# EAGLE design M219X (EAGLE 6.6.0)
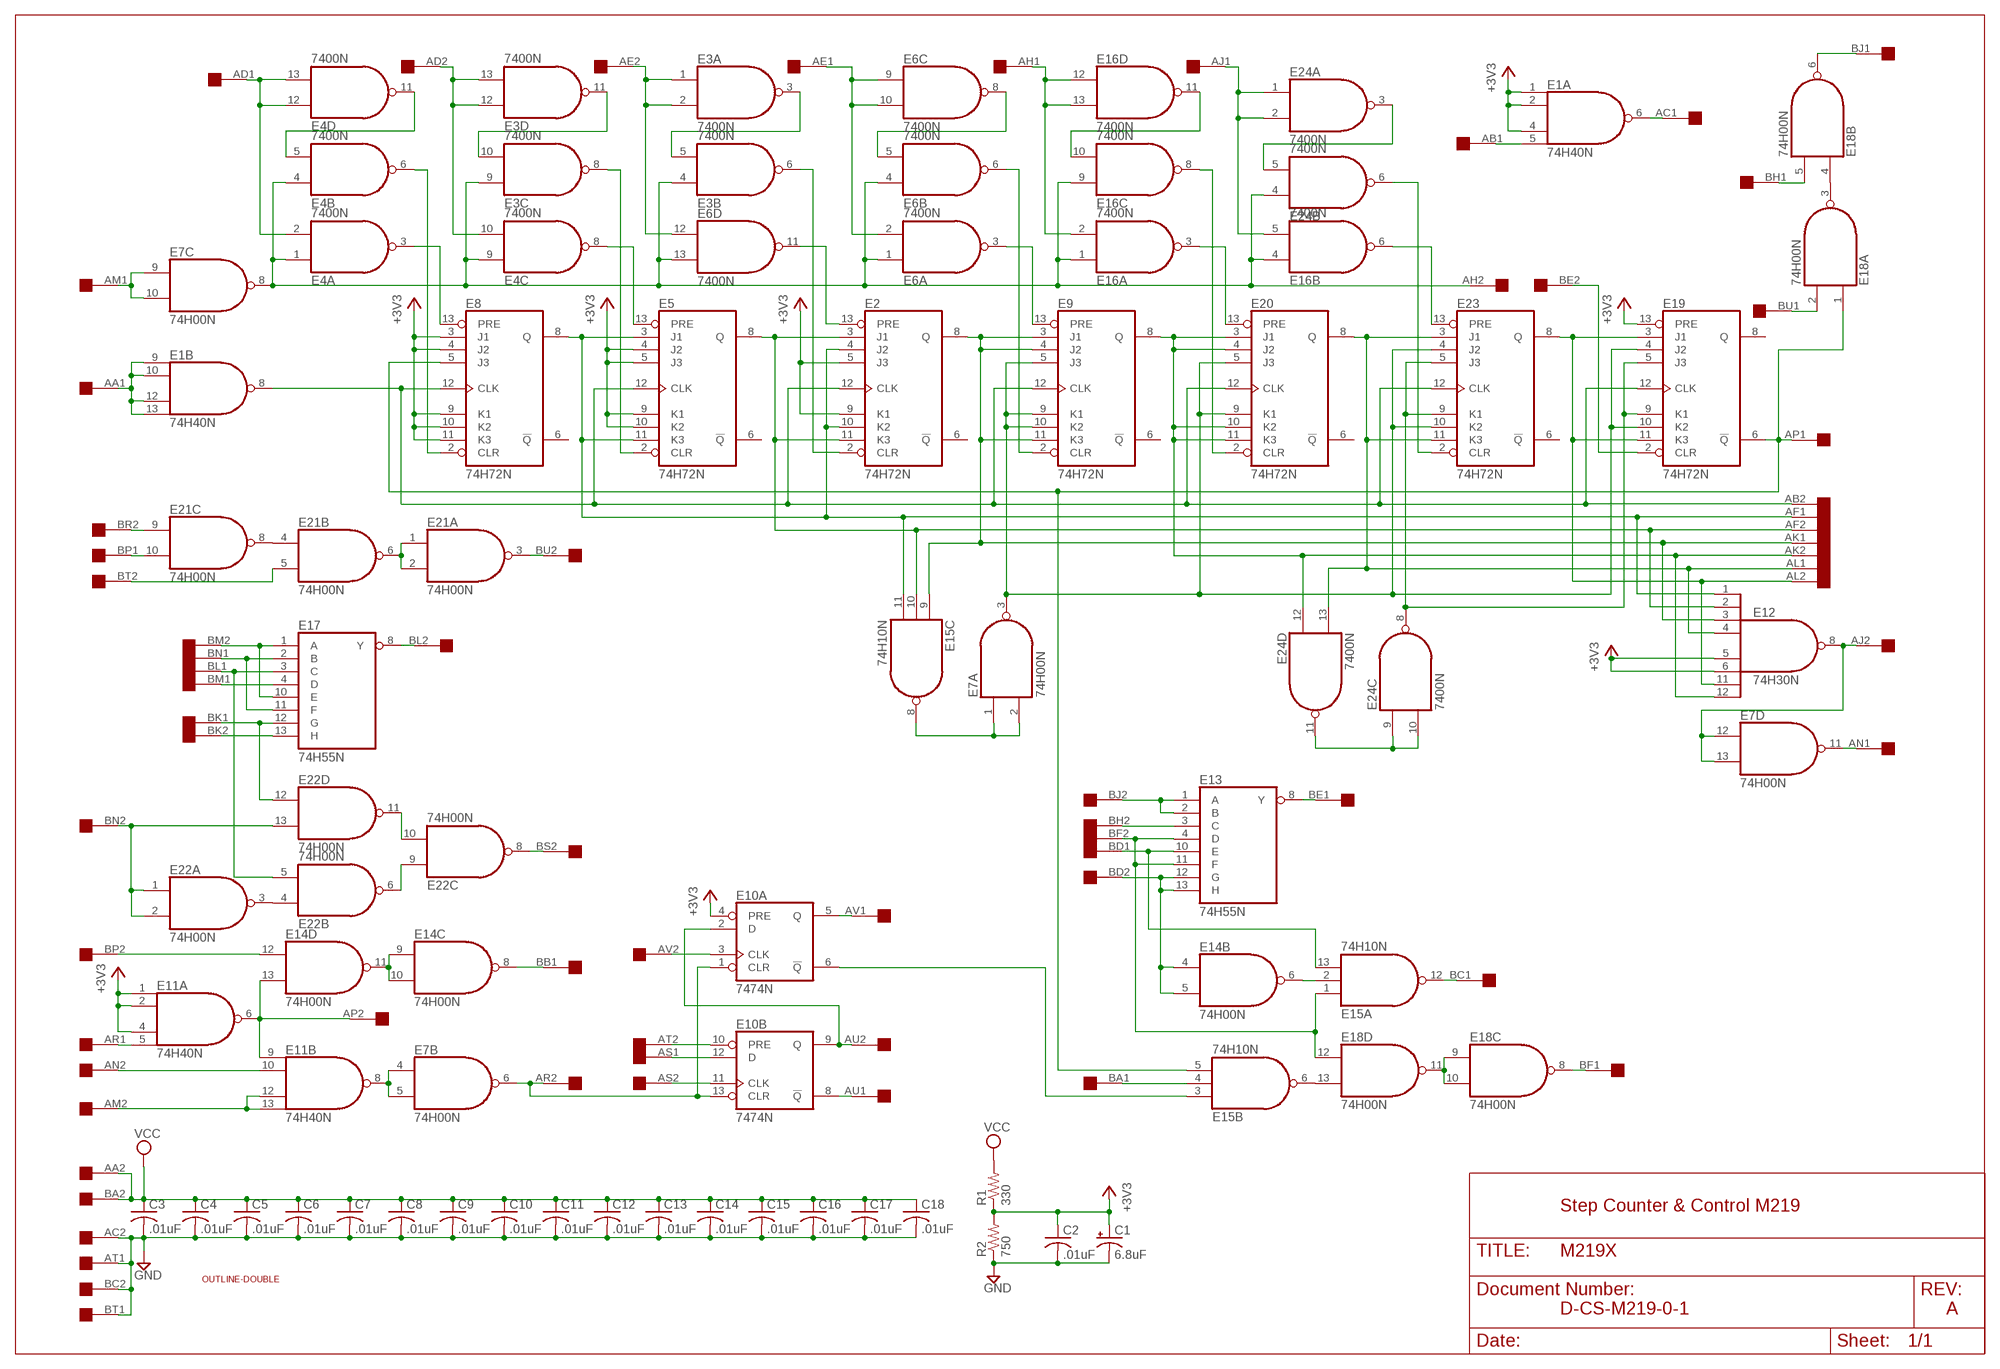
[diagram p0: schematic, sheet 1]

## Parts
C1  6.8uF  CPOL-USE20-8AXIAL  [E12-8]
C2  .01uF  C-US050-025X075  [C050-025X075]
C3  .01uF  C-US050-025X075  [C050-025X075]
C4  .01uF  C-US050-025X075  [C050-025X075]
C5  .01uF  C-US050-025X075  [C050-025X075]
C6  .01uF  C-US050-025X075  [C050-025X075]
C7  .01uF  C-US050-025X075  [C050-025X075]
C8  .01uF  C-US050-025X075  [C050-025X075]
C9  .01uF  C-US050-025X075  [C050-025X075]
C10  .01uF  C-US050-025X075  [C050-025X075]
C11  .01uF  C-US050-025X075  [C050-025X075]
C12  .01uF  C-US050-025X075  [C050-025X075]
C13  .01uF  C-US050-025X075  [C050-025X075]
C14  .01uF  C-US050-025X075  [C050-025X075]
C15  .01uF  C-US050-025X075  [C050-025X075]
C16  .01uF  C-US050-025X075  [C050-025X075]
C17  .01uF  C-US050-025X075  [C050-025X075]
C18  .01uF  C-US050-025X075  [C050-025X075]
E1  74H40N  74S40N  [DIL14]
E2  74H72N  7472N  [DIL14]
E3  7400N  74S00N  [DIL14]
E4  7400N  74S00N  [DIL14]
E5  74H72N  7472N  [DIL14]
E6  7400N  74S00N  [DIL14]
E7  74H00N  74S00N  [DIL14]
E8  74H72N  7472N  [DIL14]
E9  74H72N  7472N  [DIL14]
E10  7474N  74S74N  [DIL14]
E11  74H40N  74S40N  [DIL14]
E12  74H30N  74S30N  [DIL14]
E13  74H55N  74LS55N  [DIL14]
E14  74H00N  74S00N  [DIL14]
E15  74H10N  74S10N  [DIL14]
E16  7400N  74S00N  [DIL14]
E17  74H55N  74LS55N  [DIL14]
E18  74H00N  74S00N  [DIL14]
E19  74H72N  7472N  [DIL14]
E20  74H72N  7472N  [DIL14]
E21  74H00N  74S00N  [DIL14]
E22  74H00N  74S00N  [DIL14]
E23  74H72N  7472N  [DIL14]
E24  7400N  74S00N  [DIL14]
R1  330  R-US_0207/10  [0207/10]
R2  750  R-US_0207/10  [0207/10]
U$1  OUTLINE-DOUBLE  [DOUBLE]
U$3  DOUBLE  [EDGE-CON4]

## Nets
+3V3 [supply]: C1.+ C2.1 E1.1(A:I0) E1.2(A:I1) E1.4(A:I2) E2.5(J3) E2.9(K1) E5.4(J2) E5.5(J3) E5.9(K1) E5.10(K2) E8.3(J1) E8.4(J2) E8.9(K1) E8.10(K2) E8.11(K3) E10.4(A:PRE) E11.1(A:I0) E11.2(A:I1) E11.4(A:I2) E12.5(I4) E12.6(I5) E19.13(PRE) R1.1 R2.2
GND [supply]: C1.- C2.2 C3.2 C4.2 C5.2 C6.2 C7.2 C8.2 C9.2 C10.2 C11.2 C12.2 C13.2 C14.2 C15.2 C16.2 C17.2 C18.2 R2.1 U$3.AC2 U$3.AT1 U$3.BC2 U$3.BT1
N$1: E1.9(B:I0) E1.10(B:I1) E1.12(B:I2) E1.13(B:I3) U$3.AA1
N$2: E1.8(B:O) E2.12(CLK) E5.12(CLK) E8.12(CLK) E9.12(CLK) E19.12(CLK) E20.12(CLK) E23.12(CLK) U$3.AB2
N$3: E4.2(A:I1) E4.12(D:I0) E4.13(D:I1) U$3.AD1
N$4: E7.9(C:I0) E7.10(C:I1) U$3.AM1
N$5: E8.5(J3) E15.5(B:I2) E18.1(A:I0) E19.6(!Q) U$3.AP1
N$6: E3.4(B:I0) E3.9(C:I0) E4.1(A:I0) E4.4(B:I0) E4.9(C:I0) E6.1(A:I0) E6.4(B:I0) E6.13(D:I1) E7.8(C:O) E16.1(A:I0) E16.4(B:I0) E16.9(C:I0) E24.4(B:I0) U$3.AH2
N$7: E4.5(B:I1) E4.11(D:O)
N$8: E4.3(A:O) E8.13(PRE)
N$9: E4.8(C:O) E5.13(PRE)
N$10: E3.12(D:I0) E3.13(D:I1) E4.10(C:I1) U$3.AD2
N$11: E6.3(A:O) E9.13(PRE)
N$12: E6.2(A:I1) E6.9(C:I0) E6.10(C:I1) U$3.AE1
N$13: E3.1(A:I0) E3.2(A:I1) E6.12(D:I0) U$3.AE2
N$14: E2.13(PRE) E6.11(D:O)
N$15: E16.3(A:O) E20.13(PRE)
N$16: E16.6(B:O) E23.13(PRE)
N$17: E4.6(B:O) E8.2(CLR)
N$18: E3.8(C:O) E5.2(CLR)
N$19: E3.10(C:I1) E3.11(D:O)
N$20: E2.4(J2) E2.10(K2) E5.3(J1) E5.11(K3) E8.8(Q) E12.1(I0) E15.11(C:I2) U$3.AF1
N$21: E2.3(J1) E2.11(K3) E5.8(Q) E12.2(I1) E15.10(C:I1) U$3.AF2
N$22: E2.8(Q) E9.3(J1) E9.4(J2) E9.11(K3) E12.3(I2) E15.9(C:I0) U$3.AK1
N$23: E9.8(Q) E12.12(I7) E20.3(J1) E20.4(J2) E20.10(K2) E20.11(K3) E24.12(D:I0) U$3.AK2
N$24: E12.4(I3) E20.8(Q) E23.3(J1) E23.11(K3) E24.13(D:I1) U$3.AL1
N$25: E12.11(I6) E19.3(J1) E19.11(K3) E23.8(Q) U$3.AL2
N$26: E2.2(CLR) E3.6(B:O)
N$27: E3.3(A:O) E3.5(B:I1)
N$28: E6.5(B:I1) E6.8(C:O)
N$29: E6.6(B:O) E9.2(CLR)
N$30: E7.3(A:O) E9.5(J3) E9.9(K1) E9.10(K2) E19.4(J2) E19.10(K2) E20.5(J3) E20.9(K1) E23.4(J2) E23.10(K2)
N$31: E7.1(A:I0) E7.2(A:I1) E15.8(C:O)
N$32: E16.10(C:I1) E16.11(D:O)
N$33: E16.2(A:I1) E16.12(D:I0) E16.13(D:I1) U$3.AH1
N$34: E16.8(C:O) E20.2(CLR)
N$36: E24.3(A:O) E24.5(B:I1)
N$37: E16.5(B:I1) E24.1(A:I0) E24.2(A:I1) U$3.AJ1
N$38: E23.2(CLR) E24.6(B:O)
N$39: E19.5(J3) E19.9(K1) E23.5(J3) E23.9(K1) E24.8(C:O)
N$40: E1.5(A:I3) U$3.AB1
N$41: E24.9(C:I0) E24.10(C:I1) E24.11(D:O)
N$42: E1.6(A:O) U$3.AC1
N$43: E7.12(D:I0) E7.13(D:I1) E12.8(O) U$3.AJ2
N$44: E7.11(D:O) U$3.AN1
N$45: E17.3(C) E22.5(B:I1) U$3.BL1
N$46: E18.3(A:O) E18.4(B:I0)
N$47: E18.2(A:I1) U$3.BU1
N$48: E18.5(B:I1) U$3.BH1
N$49: E18.6(B:O) U$3.BJ1
N$50: E21.4(B:I0) E21.8(C:O)
N$51: E21.9(C:I0) U$3.BR2
N$52: E21.10(C:I1) U$3.BP1
N$53: E21.5(B:I1) U$3.BT2
N$54: E21.1(A:I0) E21.2(A:I1) E21.6(B:O)
N$55: E21.3(A:O) U$3.BU2
N$56: E22.6(B:O) E22.9(C:I0)
N$57: E22.10(C:I1) E22.11(D:O)
N$58: E22.3(A:O) E22.4(B:I0)
N$59: E22.1(A:I0) E22.2(A:I1) E22.13(D:I1) U$3.BN2
N$60: E17.12(G) E22.12(D:I0) U$3.BK1
N$61: E17.4(D) U$3.BM1
N$62: E17.1(A) E17.10(E) U$3.BM2
N$63: E17.2(B) E17.11(F) U$3.BN1
N$64: E17.13(H) U$3.BK2
N$65: E17.8(Y) U$3.BL2
N$66: E22.8(C:O) U$3.BS2
N$67: E11.5(A:I3) U$3.AR1
N$68: E11.6(A:O) E11.9(B:I0) E14.13(D:I1) U$3.AP2
N$69: E11.12(B:I2) E11.13(B:I3) U$3.AM2
N$70: E11.10(B:I1) U$3.AN2
N$71: E14.12(D:I0) U$3.BP2
N$72: E14.9(C:I0) E14.10(C:I1) E14.11(D:O)
N$73: E7.4(B:I0) E7.5(B:I1) E11.8(B:O)
N$74: E14.8(C:O) U$3.BB1
N$75: E7.6(B:O) E10.1(A:CLR) E10.13(B:CLR) U$3.AR2
N$76: E10.11(B:CLK) U$3.AS2
N$77: E10.12(B:D) U$3.AS1
N$78: E10.10(B:PRE) U$3.AT2
N$79: E10.2(A:D) E10.9(B:Q) U$3.AU2
N$80: E10.3(A:CLK) U$3.AV2
N$81: E10.5(A:Q) U$3.AV1
N$82: E10.8(B:!Q) U$3.AU1
N$83: E13.1(A) E13.2(B) U$3.BJ2
N$84: E13.3(C) U$3.BH2
N$85: E13.4(D) E13.11(F) E15.1(A:I0) E18.12(D:I0) U$3.BF2
N$86: E13.10(E) E15.13(A:I2) U$3.BD1
N$87: E13.12(G) E13.13(H) E14.4(B:I0) E14.5(B:I1) U$3.BD2
N$88: E14.6(B:O) E15.2(A:I1)
N$89: E13.8(Y) U$3.BE1
N$90: E15.12(A:O) U$3.BC1
N$91: E15.4(B:I1) U$3.BA1
N$92: E15.6(B:O) E18.13(D:I1)
N$93: E10.6(A:!Q) E15.3(B:I0)
N$95: E18.9(C:I0) E18.10(C:I1) E18.11(D:O)
N$96: E18.8(C:O) U$3.BF1
N$97: E19.2(CLR) U$3.BE2
VCC [supply]: C3.1 C4.1 C5.1 C6.1 C7.1 C8.1 C9.1 C10.1 C11.1 C12.1 C13.1 C14.1 C15.1 C16.1 C17.1 C18.1 R1.2 U$3.AA2 U$3.BA2
Unconnected: E1.3(3:NC) E1.11(11:NC) E2.6(!Q) E5.6(!Q) E8.6(!Q) E9.6(!Q) E11.3(3:NC) E11.11(11:NC) E12.9 E12.10 E12.13 E14.1(A:I0) E14.2(A:I1) E14.3(A:O) E19.8(Q) E20.6(!Q) E21.11(D:O) E21.12(D:I0) E21.13(D:I1) E23.6(!Q) U$3.BB2 U$3.BR1 U$3.BS1 U$3.BV1 U$3.BV2

## Notes on the sheet
- Step Counter & Control M219
- D-CS-M219-0-1 | A

## Power pins joined to a net without a drawn wire
GND: E1.7(P:GND) E2.7(GND) E3.7(P:GND) E4.7(P:GND) E5.7(GND) E6.7(P:GND) E7.7(P:GND) E8.7(GND) E9.7(GND) E10.7(P:GND) E11.7(P:GND) E12.7(GND) E13.7(GND) E14.7(P:GND) E15.7(P:GND) E16.7(P:GND) E17.7(GND) E18.7(P:GND) E19.7(GND) E20.7(GND) E21.7(P:GND) E22.7(P:GND) E23.7(GND) E24.7(P:GND)
VCC: E1.14(P:VCC) E2.14(VCC) E3.14(P:VCC) E4.14(P:VCC) E5.14(VCC) E6.14(P:VCC) E7.14(P:VCC) E8.14(VCC) E9.14(VCC) E10.14(P:VCC) E11.14(P:VCC) E12.14(VCC) E13.14(VCC) E14.14(P:VCC) E15.14(P:VCC) E16.14(P:VCC) E17.14(VCC) E18.14(P:VCC) E19.14(VCC) E20.14(VCC) E21.14(P:VCC) E22.14(P:VCC) E23.14(VCC) E24.14(P:VCC)

## Library data of the parts
C1 = dec-con:CPOL-USE20-8AXIAL: A 0.8 inch electrolytic.
C2-C18 = rcl:C-US: CAPACITOR, American symbol
E1 E11 = dec-con:74*40: Dual 4-input NAND gate
E2 E5 E8 E9 E19 E20 E23 = 74xx-us:74*72: AND gated J-K master slave FLIP FLOP, preset and clear
E3 E4 E6 E7 E14 E16 E18 E21 E22 E24 = 74xx-us:74*00: Quad 2-input NAND gate
E10 = 74xx-us:74*74: Dual D type positive edge triggered FLIP FLOP, preset and clear
E12 = dec-con:74*30: 8-input NAND gate
E13 E17 = 74xx-us:74*55: 2-wide 4-input AND OR INVERTER gate
E15 = 74xx-us:74*10: Triple 3-input NAND gate
R1 R2 = rcl:R-US_: RESISTOR, American symbol
U$1 = dec-con:OUTLINE-*: Board outlines for DEC boards.
U$3 = dec-con:DOUBLE: Double-Height DEC board

## Net classes
1 supply: width 0.813 mm

## Board
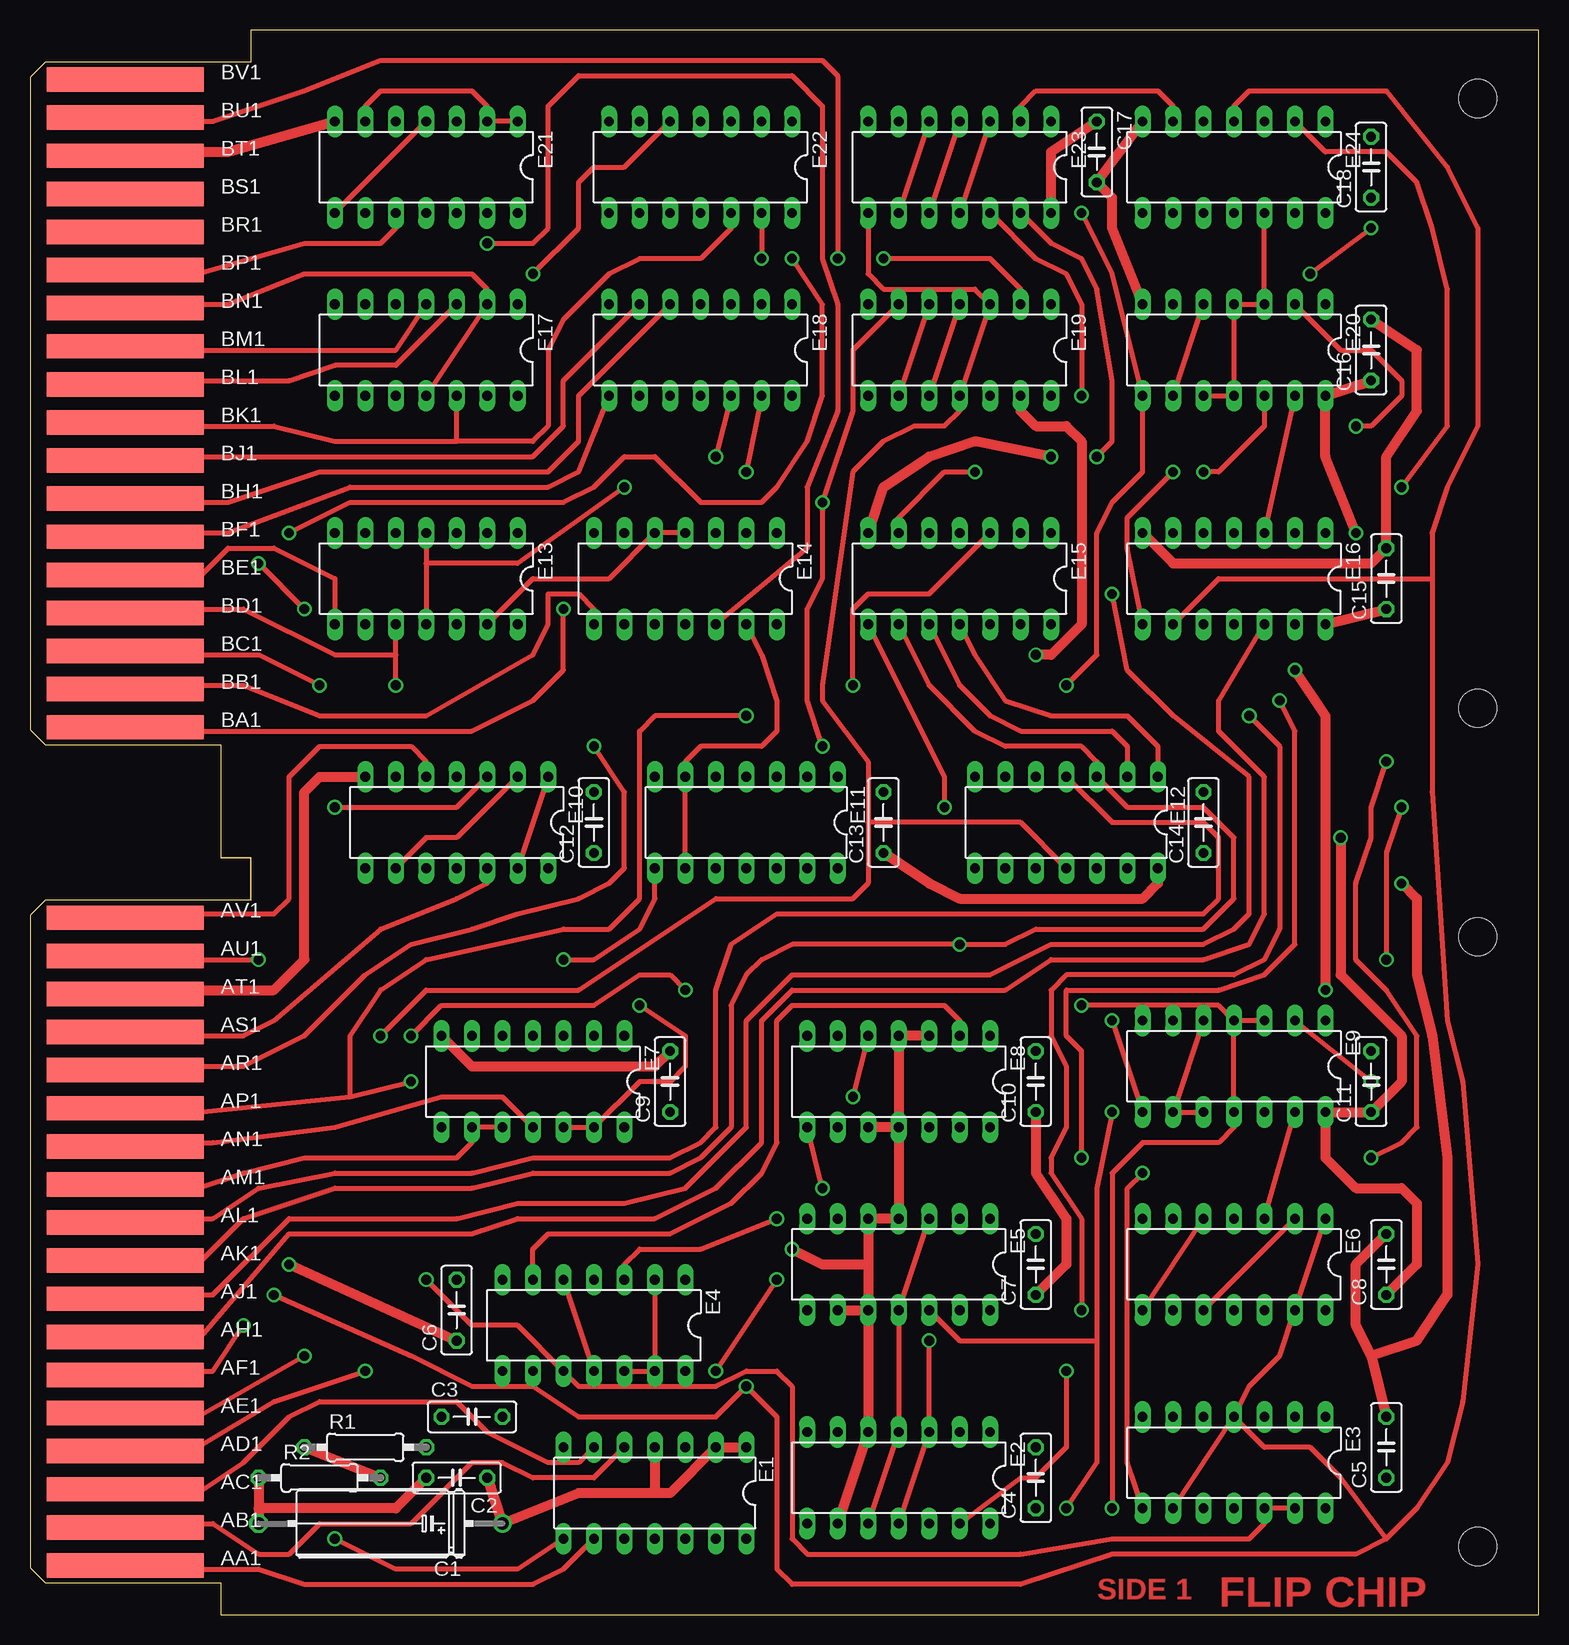
[diagram p1: board, top side]
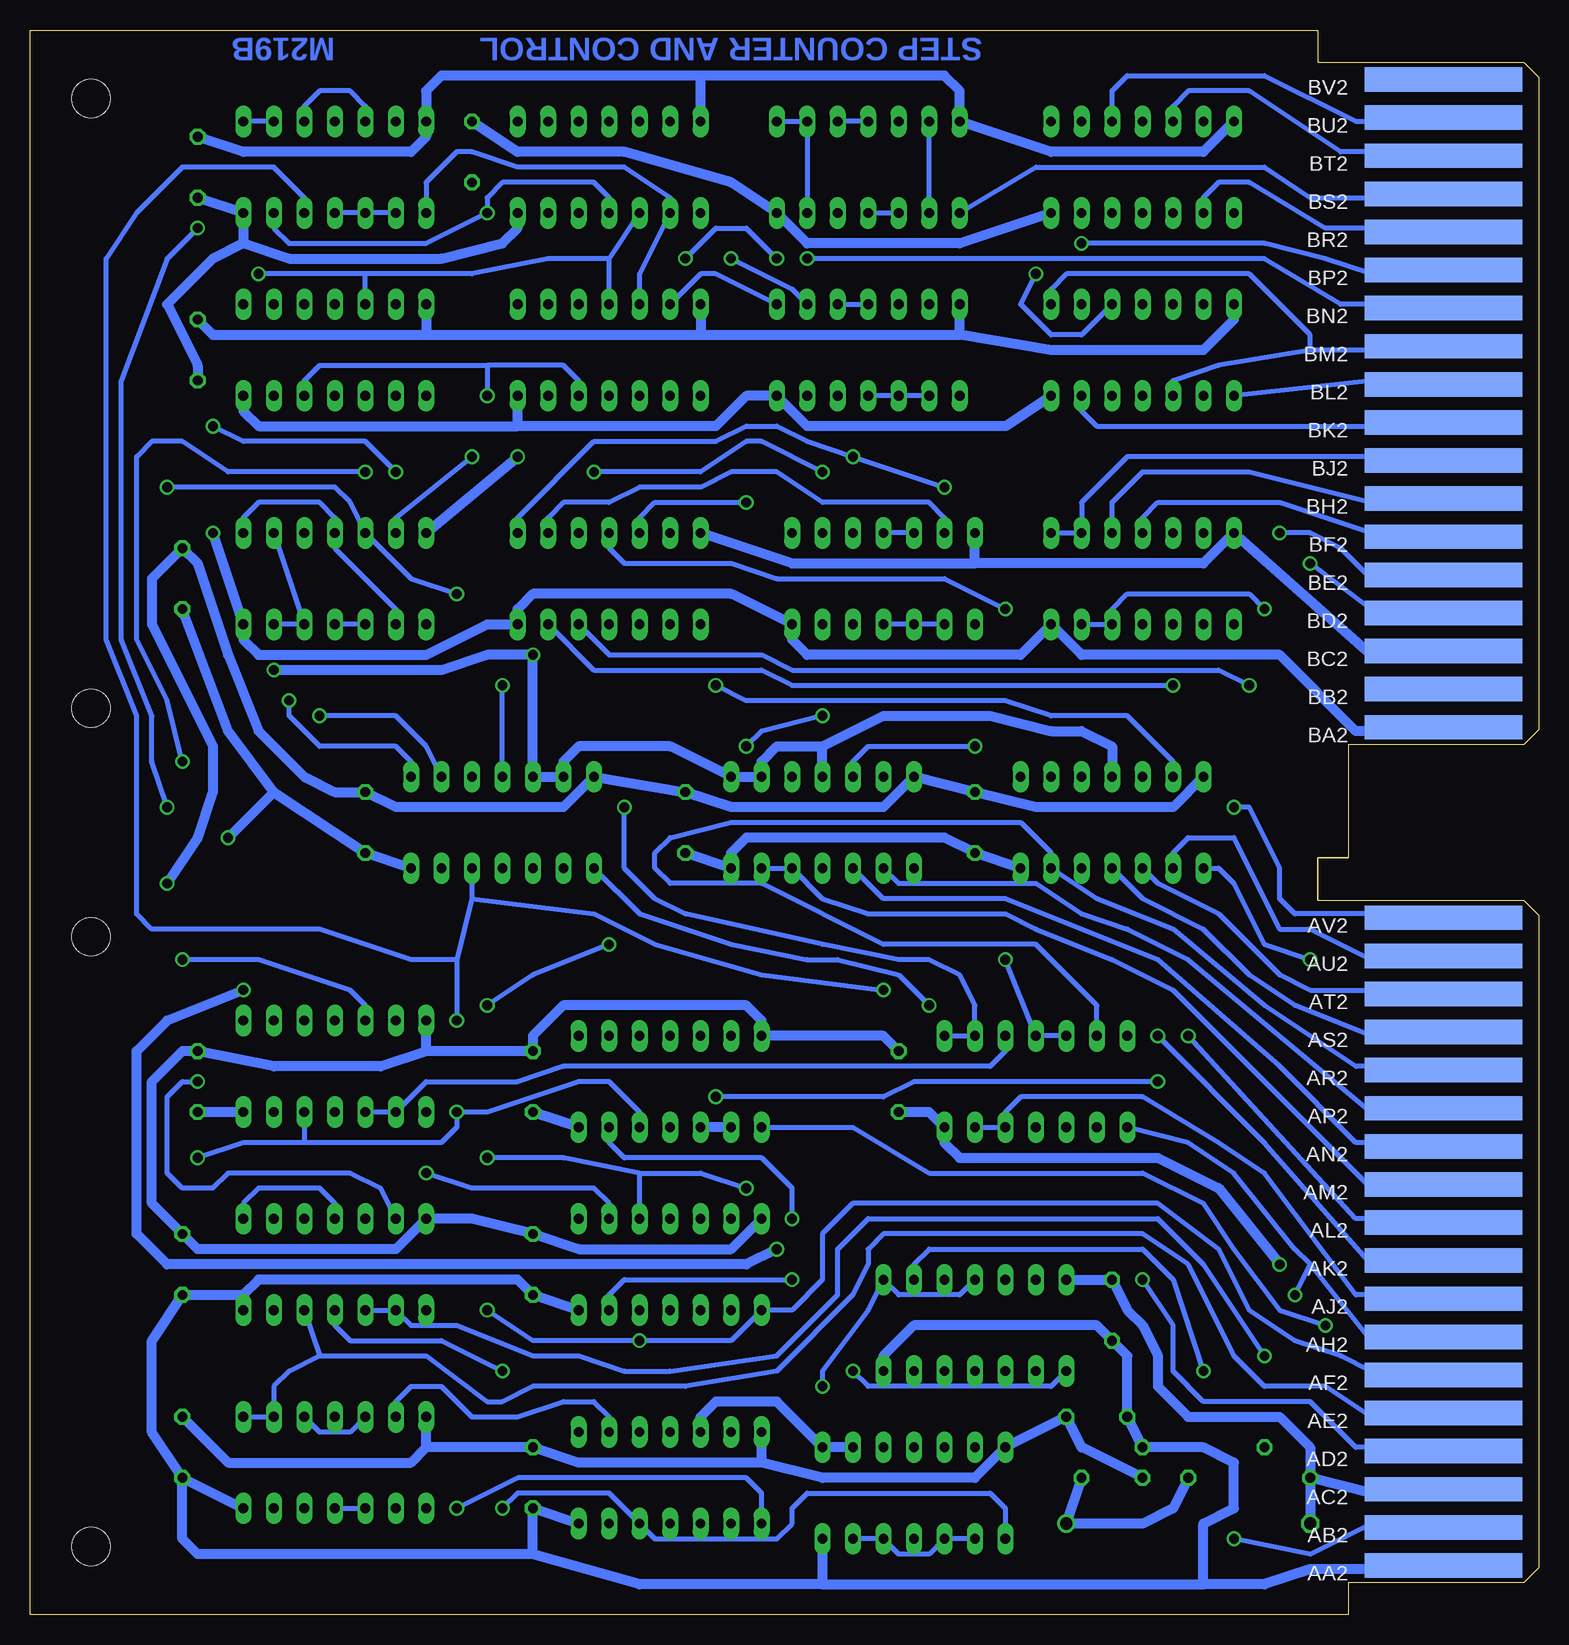
[diagram p2: board, bottom side, seen from below]

Size 125.73 x 132.08 mm. Coordinates in mm from the lower left corner, seen from the top.
Copper layers (1+16): Top 0.035mm / dielectric 1.5mm / Bottom 0.035mm
Design rules "16mils": minimum track width 16mil, minimum drill 32mil, track to track 15mil, track to pad 10mil, pad to pad 10mil, via to via 10mil, smd to smd 10mil, copper to edge 13mil, drill to drill 10mil, minimum pad ring 10mil, minimum via ring 8mil, stop-mask expansion 0mil, vias tented up to drill 0mil, thermal gap 10mil

### Footprints (pad centres in the part's own frame; a part is rotated, then mirrored left to right if it is on the bottom)
E12-8 = drill 1.016: + -10.16,0 | drill 1.016 octagon: - 10.16,0
C050-025X075 = drill 0.813 octagon: 1 -2.54,0; 2 2.54,0
DIL14 = drill 0.813 long: 1 -7.62,-3.81; 2 -5.08,-3.81; 3 -2.54,-3.81; 4 0,-3.81; 5 2.54,-3.81; 6 5.08,-3.81; 7 7.62,-3.81; 8 7.62,3.81; 9 5.08,3.81; 10 2.54,3.81; 11 0,3.81; 12 -2.54,3.81; 13 -5.08,3.81; 14 -7.62,3.81
0207/10 = drill 0.813 octagon: 1 -5.08,0; 2 5.08,0
DOUBLE = hole 3.175: 120.65,56.515; 120.65,5.715; 120.65,75.565; 120.65,126.365
EDGE-CON4 = smd 13.106 x 2.032: AA1 7.938,4.128; AB1 7.938,7.303; AC1 7.938,10.477; AD1 7.938,13.652; AE1 7.938,16.828; AF1 7.938,20.003; AH1 7.938,23.177; AJ1 7.938,26.352; AK1 7.938,29.527; AL1 7.938,32.703; AM1 7.938,35.877; AN1 7.938,39.053; AP1 7.938,42.227; AR1 7.938,45.403; AS1 7.938,48.578; AT1 7.938,51.752; AU1 7.938,54.928; AV1 7.938,58.102; BA1 7.938,73.978; BB1 7.938,77.153; BC1 7.938,80.328; BD1 7.938,83.502; BE1 7.938,86.677; BF1 7.938,89.853; BH1 7.938,93.028; BJ1 7.938,96.203; BK1 7.938,99.377; BL1 7.938,102.552; BM1 7.938,105.728; BN1 7.938,108.903; BP1 7.938,112.078; BR1 7.938,115.252; BS1 7.938,118.427; BT1 7.938,121.603; BU1 7.938,124.778; BV1 7.938,127.953 | smd 13.106 x 2.032 bottom: AA2 7.938,4.128; AB2 7.938,7.303; AC2 7.938,10.477; AD2 7.938,13.652; AE2 7.938,16.828; AF2 7.938,20.003; AH2 7.938,23.177; AJ2 7.938,26.352; AK2 7.938,29.527; AL2 7.938,32.703; AM2 7.938,35.877; AN2 7.938,39.053; AP2 7.938,42.227; AR2 7.938,45.403; AS2 7.938,48.578; AT2 7.938,51.752; AU2 7.938,54.928; AV2 7.938,58.102; BA2 7.938,73.978; BB2 7.938,77.153; BC2 7.938,80.328; BD2 7.938,83.502; BE2 7.938,86.677; BF2 7.938,89.853; BH2 7.938,93.028; BJ2 7.938,96.203; BK2 7.938,99.377; BL2 7.938,102.552; BM2 7.938,105.728; BN2 7.938,108.903; BP2 7.938,112.078; BR2 7.938,115.252; BS2 7.938,118.427; BT2 7.938,121.603; BU2 7.938,124.778; BV2 7.938,127.953

### Placement (x,y rotation side)
C1  29.21,7.62 180 top
C2  35.56,11.43 180 top
C3  36.83,16.51 0 top
C4  83.82,11.43 90 top
C5  113.03,13.97 90 top
C6  35.56,25.4 90 top
C7  83.82,29.21 90 top
C8  113.03,29.21 90 top
C9  53.34,44.45 90 top
C10  83.82,44.45 90 top
C11  111.76,44.45 90 top
C12  46.99,66.04 90 top
C13  71.12,66.04 90 top
C14  97.79,66.04 90 top
C15  113.03,86.36 90 top
C16  111.76,105.41 90 top
C17  88.9,121.92 270 top
C18  111.76,120.65 90 top
E1  52.07,10.16 180 top
E2  72.39,11.43 180 top
E3  100.33,12.7 180 top
E4  46.99,24.13 180 top
E5  72.39,29.21 180 top
E6  100.33,29.21 180 top
E7  41.91,44.45 180 top
E8  72.39,44.45 180 top
E9  100.33,45.72 180 top
E10  35.56,66.04 180 top
E11  59.69,66.04 180 top
E12  86.36,66.04 180 top
E13  33.02,86.36 180 top
E14  54.61,86.36 180 top
E15  77.47,86.36 180 top
E16  100.33,86.36 180 top
E17  33.02,105.41 180 top
E18  55.88,105.41 180 top
E19  77.47,105.41 180 top
E20  100.33,105.41 180 top
E21  33.02,120.65 180 top
E22  55.88,120.65 180 top
E23  77.47,120.65 180 top
E24  100.33,120.65 180 top
R1  27.94,13.97 0 top
R2  24.13,11.43 0 top
U$1  0,0 0 top
U$3  0,0 0 top

### Tracks (layer width: path | path; a pad name or v marks a point on that pad's centre or on a via)
+3V3  (via drill 0.81)
  Top 0.813: R1.1 R2.2 | E2.9 E2.5 E5.10 | E8.11 E5.4 E5.5 69.85,29.21 | E8.11 E8.10 | E5.9 E5.10 | E8.3 E8.4 E8.11 | E19.13 82.55,100.33 83.82,99.06 86.36,99.06 87.63,97.79 87.63,82.55 85.09,80.01 v83.82,80.01 | 69.85,29.21 E5.10 | C2.1 C1.+ 45.72,10.16 52.07,10.16 | E1.1 E1.2 53.34,10.16 52.07,10.16 | E1.4 52.07,10.16 | v105.41,78.74 107.95,74.93 v107.95,52.07 | v63.5,30.48 66.04,29.21 69.85,29.21
  Bottom 0.813: R2.2 30.48,8.89 33.02,7.62 C1.+ C2.1 | E2.5 69.85,16.51 68.58,17.78 63.5,17.78 E1.1 E1.2 | v105.41,78.74 91.44,78.74 87.63,80.01 v83.82,80.01 E12.5 E12.6 81.28,71.12 80.01,72.39 72.39,72.39 E11.1 E11.2 64.77,71.12 63.5,72.39 59.69,72.39 | E11.4 59.69,72.39 | 59.69,72.39 54.61,74.93 45.72,74.93 40.64,73.66 38.1,73.66 35.56,72.39 E10.4 | E8.9 E8.10 | v107.95,52.07 114.3,49.53 116.84,46.99 116.84,31.75 114.3,29.21 66.04,29.21 v63.5,30.48
GND  (via drill 0.81)
  Top 0.813: v114.3,60.96 115.57,59.69 115.57,53.34 116.84,48.26 118.11,38.1 118.11,26.67 115.57,22.86 111.76,21.59 | 111.76,21.59 C5.2 | 111.76,21.59 110.49,24.13 110.49,29.21 C8.2 | U$3.AT1 8.89,52.07 20.32,52.07 22.86,54.61 22.86,68.58 24.13,69.85 E10.7 | C16.2 115.57,105.41 115.57,100.33 113.03,96.52 C15.2 111.76,87.63 95.25,87.63 E16.7 | E20.7 90.17,115.57 90.17,118.11 C17.2 E24.7 | U$3.BT1 8.89,121.92 16.51,121.92 E21.7 | v85.09,96.52 78.74,97.79 74.93,96.52 71.12,93.98 E15.7 | E7.7 36.83,45.72 52.07,45.72 C9.2 | R2.1 19.05,8.89 | 19.05,8.89 C1.- | C2.2 30.48,8.89 19.05,8.89
  Bottom 0.813: U$3.AC2 8.89,10.16 13.97,10.16 R2.1 | R2.1 C1.- | E4.7 C6.2 34.29,25.4 33.02,24.13 31.75,21.59 31.75,19.05 29.21,16.51 21.59,16.51 19.05,13.97 R2.1 | C2.2 38.1,13.97 C3.2 E1.7 46.99,11.43 59.69,11.43 64.77,12.7 | 92.71,13.97 C4.2 80.01,12.7 64.77,12.7 | 92.71,13.97 E3.7 | C5.2 109.22,12.7 93.98,12.7 92.71,13.97 | E5.7 67.31,30.48 80.01,30.48 C7.2 88.9,33.02 E6.7 95.25,30.48 111.76,30.48 C8.2 115.57,34.29 115.57,44.45 113.03,46.99 C11.2 105.41,45.72 96.52,45.72 92.71,46.99 | C9.2 54.61,48.26 E8.7 64.77,49.53 66.04,50.8 81.28,50.8 83.82,48.26 C10.2 92.71,46.99 | 92.71,46.99 E9.7 | 64.77,12.7 E2.7 | E10.7 30.48,67.31 41.91,67.31 C12.2 E11.7 54.61,67.31 67.31,67.31 C13.2 E12.7 81.28,67.31 95.25,67.31 C14.2 100.33,68.58 102.87,69.85 106.68,73.66 109.22,80.01 111.76,87.63 C15.2 115.57,86.36 115.57,82.55 110.49,72.39 110.49,68.58 111.76,64.77 v114.3,60.96 | E16.7 v85.09,96.52 | U$3.BC2 10.16,80.01 13.97,80.01 E13.7 27.94,87.63 46.99,87.63 | 46.99,87.63 E14.7 | E15.7 62.23,87.63 46.99,87.63 | E17.7 25.4,107.95 27.94,105.41 40.64,105.41 48.26,106.68 | 48.26,106.68 E18.7 | E19.7 69.85,106.68 | 69.85,106.68 48.26,106.68 | E20.7 92.71,106.68 | 92.71,106.68 69.85,106.68 | C16.2 110.49,106.68 92.71,106.68 | C18.2 107.95,121.92 93.98,121.92 92.71,123.19 E24.7 92.71,127 91.44,128.27 69.85,128.27 | E23.7 69.85,128.27 | 69.85,128.27 49.53,128.27 48.26,127 E22.7 40.64,121.92 27.94,121.92 E21.7
N$1
  Top 0.406: U$3.AA1 10.16,3.81 19.05,3.81 22.86,2.54 41.91,2.54 44.45,3.81 E1.9
  Bottom 0.406: E1.13 E1.12 53.34,5.08 50.8,5.08 E1.10 E1.9
N$2  (via drill 0.81)
  Top 0.406: E1.8 40.64,3.81 30.48,3.81 v25.4,6.35 | v90.17,41.91 88.9,35.56 88.9,22.86 | 88.9,22.86 88.9,12.7 v86.36,8.89 | E5.12 77.47,22.86 88.9,22.86 | v111.76,38.1 114.3,39.37 115.57,40.64 115.57,48.26 113.03,52.07 110.49,54.61 110.49,60.96 111.76,64.77 111.76,67.31 v113.03,71.12 | E20.12 102.87,99.06 99.06,95.25 v97.79,95.25 | E23.12 83.82,113.03 86.36,111.76 87.63,109.22 v87.63,101.6
  Bottom 0.406: U$3.AB2 10.16,7.62 13.97,7.62 19.05,5.08 v25.4,6.35 | E1.8 44.45,8.89 45.72,10.16 60.96,10.16 62.23,8.89 62.23,7.62 63.5,6.35 73.66,6.35 E2.12 77.47,10.16 85.09,10.16 v86.36,8.89 | E8.12 74.93,41.91 77.47,44.45 80.01,44.45 87.63,41.91 v90.17,41.91 90.17,40.64 91.44,39.37 102.87,39.37 | 102.87,39.37 107.95,39.37 v111.76,38.1 | E9.12 102.87,39.37 | E19.12 80.01,102.87 81.28,104.14 87.63,104.14 | 87.63,104.14 v87.63,101.6 | E20.12 102.87,102.87 101.6,104.14 87.63,104.14 | v113.03,71.12 114.3,76.2 116.84,81.28 116.84,96.52 115.57,97.79 113.03,97.79 109.22,95.25 v97.79,95.25
N$3  (via drill 0.81)
  Top 0.406: U$3.AD1 8.89,13.97 13.97,13.97 20.32,17.78 v27.94,20.32 | E4.12 E4.13 E4.2
  Bottom 0.406: E4.2 52.07,29.21 50.8,30.48 33.02,30.48 30.48,27.94 v27.94,20.32
N$4
  Top 0.406: U$3.AM1 8.89,35.56 13.97,35.56 17.78,36.83 22.86,38.1 35.56,38.1 36.83,39.37 E7.9 E7.10
N$5  (via drill 0.81)
  Top 0.406: U$3.AP1 10.16,41.91 13.97,41.91 26.67,43.18 | 26.67,43.18 v31.75,44.45 | 26.67,43.18 26.67,48.26 29.21,52.07 33.02,54.61 44.45,57.15 48.26,57.15 50.8,59.69 50.8,73.66 52.07,74.93 v59.69,74.93 | v66.04,72.39 64.77,76.2 64.77,83.82 66.04,86.36 v66.04,92.71 68.58,100.33 68.58,105.41 E19.6 | E8.5 v68.58,43.18
  Bottom 0.406: E15.5 74.93,91.44 73.66,92.71 v66.04,92.71 | E18.1 68.58,111.76 69.85,111.76 E19.6 | v31.75,44.45 52.07,44.45 54.61,43.18 v68.58,43.18 | v59.69,74.93 64.77,73.66 v66.04,72.39
N$6  (via drill 0.81)
  Top 0.406: v20.32,26.67 31.75,21.59 36.83,19.05 41.91,19.05 | E4.9 41.91,19.05 | 41.91,19.05 45.72,16.51 57.15,16.51 v59.69,19.05 62.23,16.51 62.23,3.81 63.5,2.54 82.55,2.54 90.17,5.08 110.49,5.08 113.03,6.35 | E3.4 101.6,19.05 104.14,21.59 E6.13 E6.1 | E3.9 E3.4 | E24.4 100.33,125.73 101.6,127 113.03,127 118.11,120.65 120.65,115.57 120.65,99.06 118.11,93.98 116.84,90.17 116.84,86.36 | 116.84,86.36 116.84,68.58 118.11,49.53 119.38,44.45 120.65,29.21 119.38,17.78 118.11,12.7 115.57,8.89 113.03,6.35 | 113.03,6.35 109.22,11.43 106.68,13.97 102.87,13.97 E3.4 | E16.9 99.06,86.36 116.84,86.36
  Bottom 0.406: v59.69,19.05 59.69,20.32 55.88,25.4 E4.1 53.34,26.67 48.26,26.67 E4.4 | E6.4 100.33,34.29 101.6,35.56 106.68,35.56 107.95,34.29 E6.1 | U$3.AH2 10.16,22.86 13.97,22.86 19.05,29.21 | 19.05,29.21 20.32,30.48 25.4,36.83 29.21,39.37 E7.8 | v20.32,26.67 19.05,29.21 | E16.9 95.25,83.82 100.33,88.9 E16.4 100.33,91.44 101.6,92.71 106.68,92.71 107.95,91.44 E16.1
N$7
  Top 0.406: E4.5 E4.11
N$8  (via drill 0.81)
  Top 0.406: E4.3 49.53,29.21 50.8,30.48 55.88,30.48 v62.23,33.02
  Bottom 0.406: v62.23,33.02 62.23,35.56 64.77,38.1 76.2,38.1 77.47,39.37 E8.13
N$9  (via drill 0.81)
  Top 0.406: v62.23,27.94 v57.15,20.32
  Bottom 0.406: E4.8 40.64,19.05 55.88,19.05 v57.15,20.32 | E5.13 77.47,26.67 76.2,27.94 v62.23,27.94
N$10  (via drill 0.81)
  Top 0.406: E3.13 E3.12 102.87,7.62 101.6,6.35 90.17,6.35 82.55,5.08 64.77,5.08 63.5,6.35 63.5,19.05 62.23,20.32 59.69,20.32 57.15,19.05 45.72,19.05 E4.10 40.64,24.13 36.83,24.13 v33.02,27.94
  Bottom 0.406: U$3.AD2 11.43,13.97 15.24,13.97 19.05,17.78 27.94,17.78 30.48,20.32 30.48,24.13 v33.02,27.94
N$11
  Top 0.406: E6.3 E9.13
N$12  (via drill 0.81)
  Top 0.406: U$3.AE1 8.89,16.51 13.97,16.51 v22.86,21.59 | E6.10 E6.2
  Bottom 0.406: v22.86,21.59 27.94,29.21 31.75,33.02 55.88,33.02 58.42,30.48 58.42,26.67 63.5,21.59 72.39,20.32 76.2,20.32 80.01,21.59 83.82,21.59 90.17,24.13 93.98,24.13 E6.9 E6.10
N$13
  Bottom 0.406: U$3.AE2 11.43,16.51 13.97,16.51 17.78,19.05 22.86,19.05 25.4,21.59 29.21,29.21 33.02,31.75 54.61,31.75 55.88,30.48 55.88,29.21 57.15,26.67 63.5,20.32 71.12,19.05 83.82,19.05 86.36,17.78 87.63,17.78 92.71,21.59 101.6,21.59 | E6.12 101.6,21.59 | 101.6,21.59 104.14,20.32 105.41,19.05 E3.2 E3.1
N$14  (via drill 0.81)
  Top 0.406: v86.36,20.32 86.36,13.97 83.82,11.43 82.55,11.43 E2.13
  Bottom 0.406: E6.11 100.33,24.13 99.06,22.86 91.44,22.86 v86.36,20.32
N$15
  Top 0.406: E20.13 E16.3
N$16  (via drill 0.81)
  Top 0.406: v88.9,96.52 90.17,97.79 90.17,102.87 88.9,110.49 87.63,113.03 85.09,114.3 E23.13
  Bottom 0.406: E16.6 95.25,91.44 v88.9,96.52
N$17
  Top 0.406: E4.6 41.91,30.48 43.18,31.75 53.34,31.75 58.42,34.29 60.96,36.83 62.23,39.37 62.23,49.53 63.5,50.8 76.2,50.8 77.47,49.53 E8.2
N$18  (via drill 0.81)
  Top 0.406: E3.8 91.44,12.7 91.44,35.56 v92.71,36.83
  Bottom 0.406: E5.2 77.47,34.29 78.74,35.56 88.9,35.56 v92.71,36.83
N$19
  Bottom 0.406: E3.11 E3.10
N$20  (via drill 0.81)
  Top 0.406: U$3.AF1 8.89,20.32 15.24,20.32 v17.78,24.13 | v66.04,35.56 E8.8 | E2.10 E2.4 E5.11 E5.3 | v87.63,38.1 87.63,46.99 86.36,48.26 86.36,52.07 99.06,52.07 102.87,53.34 105.41,55.88 105.41,73.66 v104.14,76.2 | E15.11 78.74,80.01 81.28,76.2 85.09,74.93 91.44,74.93 93.98,72.39 E12.1
  Bottom 0.406: E5.3 74.93,36.83 | 74.93,36.83 69.85,36.83 v66.04,35.56 | 74.93,36.83 81.28,38.1 v87.63,38.1 | E8.8 57.15,40.64 50.8,36.83 33.02,36.83 27.94,34.29 25.4,30.48 21.59,25.4 v17.78,24.13 | E12.1 93.98,71.12 95.25,72.39 101.6,72.39 104.14,74.93 v104.14,76.2
N$21  (via drill 0.81)
  Top 0.406: v74.93,22.86 E2.3 E2.11 | v101.6,74.93 104.14,72.39 104.14,57.15 102.87,54.61 100.33,53.34 86.36,53.34 85.09,52.07 85.09,48.26 86.36,45.72 86.36,40.64 85.09,38.1 85.09,36.83 87.63,33.02 v87.63,25.4 | E15.10 77.47,77.47 80.01,74.93 82.55,73.66 90.17,73.66 91.44,72.39 E12.2
  Bottom 0.406: v87.63,25.4 83.82,22.86 v74.93,22.86 67.31,22.86 E5.8 62.23,25.4 59.69,27.94 59.69,31.75 57.15,34.29 31.75,34.29 26.67,30.48 24.13,25.4 20.32,22.86 16.51,21.59 13.97,20.32 11.43,20.32 U$3.AF2 | E12.2 92.71,72.39 95.25,74.93 v101.6,74.93
N$22  (via drill 0.81)
  Top 0.406: E9.3 E9.4 | v90.17,8.89 90.17,36.83 92.71,39.37 99.06,39.37 100.33,40.64 E9.11 E9.4 | E9.4 99.06,50.8 v87.63,50.8 | U$3.AK1 8.89,29.21 13.97,29.21 17.78,33.02 25.4,35.56 36.83,35.56 41.91,36.83 53.34,36.83 55.88,38.1 58.42,40.64 58.42,50.8 59.69,53.34 60.96,54.61 63.5,55.88 v77.47,55.88 81.28,55.88 83.82,57.15 97.79,57.15 100.33,59.69 100.33,64.77 97.79,67.31 91.44,67.31 E12.3 88.9,71.12 87.63,72.39 81.28,72.39 78.74,73.66 74.93,77.47 E15.9
  Bottom 0.406: E2.8 64.77,10.16 66.04,11.43 85.09,11.43 v90.17,8.89 | v77.47,55.88 83.82,53.34 v87.63,50.8
N$23  (via drill 0.81)
  Top 0.406: v90.17,49.53 E9.8 | v31.75,48.26 34.29,50.8 46.99,50.8 50.8,53.34 53.34,53.34 v54.61,52.07 | E24.12 E20.3 E20.4 E20.11 E20.10
  Bottom 0.406: E12.12 88.9,59.69 | 88.9,59.69 90.17,54.61 | 90.17,54.61 v90.17,49.53 | 90.17,54.61 93.98,54.61 101.6,57.15 115.57,57.15 116.84,58.42 116.84,74.93 119.38,81.28 119.38,113.03 116.84,116.84 113.03,120.65 105.41,120.65 102.87,118.11 E24.12 | 88.9,59.69 78.74,58.42 73.66,55.88 64.77,53.34 v54.61,52.07 | U$3.AK2 10.16,29.21 13.97,29.21 22.86,39.37 v31.75,48.26
N$24  (via drill 0.81)
  Top 0.406: U$3.AL1 8.89,33.02 15.24,33.02 19.05,35.56 25.4,36.83 36.83,36.83 41.91,38.1 53.34,38.1 55.88,39.37 57.15,40.64 57.15,52.07 58.42,55.88 62.23,58.42 97.79,58.42 99.06,59.69 99.06,64.77 97.79,66.04 90.17,66.04 E12.4 | v87.63,116.84 90.17,111.76 E20.8 92.71,95.25 90.17,92.71 88.9,90.17 88.9,80.01 v86.36,77.47 | E23.3 E23.11
  Bottom 0.406: E12.4 v86.36,77.47 | E24.13 105.41,115.57 104.14,114.3 92.71,114.3 v87.63,116.84 87.63,118.11 86.36,119.38 78.74,119.38 77.47,118.11 E23.11
N$25  (via drill 0.81)
  Top 0.406: v29.21,48.26 33.02,52.07 45.72,52.07 57.15,59.69 68.58,59.69 69.85,60.96 69.85,66.04 | 69.85,66.04 69.85,71.12 66.04,76.2 66.04,77.47 68.58,95.25 71.12,97.79 73.66,99.06 76.2,99.06 77.47,100.33 E19.11 E19.3 78.74,110.49 71.12,110.49 69.85,111.76 E23.8 | E12.11 82.55,66.04 69.85,66.04
  Bottom 0.406: U$3.AL2 10.16,33.02 15.24,33.02 v29.21,48.26
N$26
  Bottom 0.406: E3.6 95.25,17.78 93.98,19.05 91.44,19.05 88.9,16.51 85.09,16.51 81.28,17.78 78.74,17.78 77.47,16.51 E2.2
N$27
  Bottom 0.406: E3.5 99.06,15.24 101.6,15.24 E3.3
N$28
  Top 0.406: E6.8 E6.5
N$29  (via drill 0.81)
  Top 0.406: v111.76,44.45 E9.2
  Bottom 0.406: E6.6 96.52,35.56 99.06,36.83 109.22,36.83 110.49,35.56 113.03,35.56 114.3,36.83 114.3,43.18 113.03,44.45 v111.76,44.45
N$30  (via drill 0.81)
  Top 0.406: v114.3,67.31 113.03,63.5 v113.03,54.61 | E9.5 E9.9 E9.10 | v106.68,111.76 v111.76,115.57 | E20.9 E20.5 | E23.4 E23.10 | E19.4 E19.10
  Bottom 0.406: E9.5 97.79,50.8 99.06,52.07 106.68,54.61 v113.03,54.61 | E7.3 44.45,46.99 45.72,45.72 81.28,45.72 85.09,44.45 92.71,44.45 E9.9 E9.10 | E19.4 77.47,113.03 | 77.47,113.03 E23.10 | 77.47,113.03 82.55,113.03 88.9,111.76 97.79,111.76 | 97.79,111.76 v106.68,111.76 | v114.3,67.31 115.57,71.12 115.57,74.93 118.11,81.28 118.11,102.87 114.3,113.03 v111.76,115.57 | E20.5 97.79,111.76
N$31  (via drill 0.81)
  Top 0.406: E15.8 76.2,69.85 v76.2,67.31
  Bottom 0.406: v76.2,67.31 76.2,62.23 73.66,59.69 71.12,58.42 59.69,55.88 53.34,54.61 50.8,54.61 48.26,53.34 46.99,50.8 E7.2 E7.1
N$32
  Bottom 0.406: E16.10 E16.11
N$33
  Top 0.406: U$3.AH1 8.89,22.86 13.97,22.86 21.59,31.75 36.83,31.75 40.64,33.02 52.07,33.02 57.15,35.56 60.96,39.37 60.96,49.53 63.5,52.07 81.28,52.07 85.09,54.61 97.79,54.61 101.6,55.88 102.87,58.42 102.87,69.85 99.06,73.66 99.06,76.2 E16.12
  Bottom 0.406: E16.13 E16.12 E16.2
N$34  (via drill 0.81)
  Top 0.406: E20.2 109.22,105.41 111.76,105.41 114.3,102.87 114.3,101.6 111.76,99.06 v110.49,99.06 | E16.8 91.44,88.9 91.44,91.44 v95.25,95.25
  Bottom 0.406: v95.25,95.25 97.79,97.79 107.95,97.79 v110.49,99.06
N$36
  Bottom 0.406: E24.5 97.79,125.73 99.06,127 101.6,127 102.87,125.73 E24.3
N$37  (via drill 0.81)
  Top 0.406: U$3.AJ1 8.89,26.67 15.24,26.67 21.59,33.02 35.56,33.02 40.64,34.29 49.53,34.29 54.61,35.56 59.69,40.64 59.69,49.53 63.5,53.34 80.01,53.34 85.09,55.88 97.79,55.88 100.33,57.15 101.6,58.42 101.6,69.85 95.25,74.93 91.44,78.74 v90.17,85.09 | v114.3,93.98 118.11,99.06 118.11,110.49 116.84,115.57 115.57,119.38 113.03,121.92 107.95,121.92 E24.2
  Bottom 0.406: v90.17,85.09 93.98,86.36 E16.5 99.06,92.71 100.33,93.98 v114.3,93.98 | E24.2 E24.1
N$38
  Top 0.406: E23.2 82.55,125.73 83.82,127 93.98,127 95.25,125.73 E24.6
N$39
  Top 0.406: E23.5 E23.9 | E19.5 E19.9
  Bottom 0.406: E24.8 92.71,119.38 90.17,121.92 88.9,121.92 85.09,120.65 76.2,120.65 72.39,118.11 E23.9 74.93,111.76 E19.5
N$40
  Top 0.406: U$3.AB1 8.89,7.62 15.24,7.62 19.05,5.08 21.59,5.08 24.13,7.62 31.75,7.62 36.83,12.7 39.37,12.7 41.91,11.43 46.99,11.43 E1.5
N$41
  Bottom 0.406: E24.9 E24.10 E24.11
N$42
  Top 0.406: U$3.AC1 8.89,10.16 13.97,10.16 17.78,12.7 21.59,16.51 24.13,17.78 35.56,17.78 38.1,15.24 43.18,12.7 45.72,12.7 E1.6
N$43  (via drill 0.81)
  Top 0.406: E7.12 E7.13 50.8,44.45 53.34,44.45 54.61,45.72 54.61,48.26 v50.8,50.8
  Bottom 0.406: E12.8 74.93,58.42 67.31,55.88 60.96,54.61 58.42,54.61 53.34,53.34 v50.8,50.8 | U$3.AJ2 10.16,26.67 15.24,26.67 22.86,36.83 26.67,39.37 33.02,43.18 43.18,43.18 44.45,41.91 E7.12 E7.13
N$44
  Top 0.406: U$3.AN1 8.89,39.37 15.24,39.37 25.4,40.64 34.29,43.18 39.37,43.18 E7.11
N$45  (via drill 0.81)
  Top 0.406: U$3.BL1 10.16,102.87 21.59,102.87 25.4,104.14 30.48,104.14 E17.3 | v41.91,111.76 45.72,115.57 45.72,119.38 46.99,120.65 49.53,120.65 E22.5
  Bottom 0.406: E17.3 38.1,106.68 40.64,106.68 43.18,109.22 v41.91,111.76
N$46
  Bottom 0.406: E18.3 E18.4
N$47  (via drill 0.81)
  Top 0.406: U$3.BU1 8.89,124.46 15.24,124.46 22.86,127 29.21,129.54 66.04,129.54 67.31,128.27 v67.31,113.03
  Bottom 0.406: E18.2 62.23,110.49 v67.31,113.03
N$48
  Top 0.406: U$3.BH1 8.89,92.71 16.51,92.71 24.13,95.25 43.18,95.25 45.72,97.79 45.72,101.6 E18.5
N$49
  Top 0.406: U$3.BJ1 8.89,96.52 41.91,96.52 44.45,99.06 44.45,102.87 E18.6
N$50
  Top 0.406: E21.8 E21.4
N$51
  Bottom 0.406: U$3.BR2 8.89,115.57 17.78,115.57 24.13,119.38 26.67,119.38 27.94,118.11 E21.9
N$52
  Top 0.406: U$3.BP1 8.89,111.76 13.97,111.76 22.86,114.3 29.21,114.3 30.48,115.57 E21.10
N$53
  Bottom 0.406: U$3.BT2 10.16,121.92 16.51,121.92 24.13,127 29.21,127 30.48,125.73 E21.5
N$54
  Top 0.406: E21.6 27.94,125.73 29.21,127 36.83,127 38.1,125.73 E21.2 E21.1
N$55
  Bottom 0.406: E21.3 35.56,127 34.29,128.27 22.86,128.27 15.24,124.46 8.89,124.46 U$3.BU2
N$56
  Bottom 0.406: E22.9 E22.6
N$57
  Bottom 0.406: E22.11 E22.10
N$58
  Bottom 0.406: E22.4 E22.3
N$59  (via drill 0.81)
  Top 0.406: E22.13 v60.96,113.03
  Bottom 0.406: U$3.BN2 10.16,109.22 16.51,109.22 22.86,113.03 v60.96,113.03 | E22.13 E22.2 E22.1
N$60
  Top 0.406: E22.12 58.42,115.57 55.88,113.03 50.8,113.03 48.26,111.76 44.45,107.95 43.18,105.41 43.18,99.06 41.91,97.79 35.56,97.79 | 35.56,97.79 E17.12 | U$3.BK1 8.89,99.06 20.32,99.06 25.4,97.79 35.56,97.79
N$61
  Top 0.406: U$3.BM1 8.89,105.41 30.48,105.41 E17.4
N$62
  Bottom 0.406: U$3.BM2 10.16,105.41 19.05,105.41 | 19.05,105.41 26.67,104.14 30.48,102.87 E17.10 | 19.05,105.41 19.05,106.68 24.13,111.76 39.37,111.76 40.64,110.49 E17.1
N$63
  Top 0.406: U$3.BN1 8.89,109.22 16.51,109.22 22.86,111.76 36.83,111.76 38.1,110.49 E17.2 E17.11
N$64
  Bottom 0.406: E17.13 38.1,100.33 36.83,99.06 8.89,99.06 U$3.BK2
N$65
  Bottom 0.406: U$3.BL2 10.16,102.87 13.97,102.87 E17.8
N$66
  Bottom 0.406: E22.8 41.91,120.65 22.86,120.65 19.05,118.11 8.89,118.11 U$3.BS2
N$67  (via drill 0.81)
  Top 0.406: U$3.AR1 8.89,45.72 17.78,45.72 22.86,48.26 27.94,53.34 31.75,55.88 36.83,57.15 40.64,58.42 45.72,59.69 48.26,60.96 49.53,62.23 49.53,68.58 v46.99,72.39
  Bottom 0.406: E11.5 57.15,71.12 55.88,72.39 v46.99,72.39
N$68
  Top 0.406: E11.9 E11.6 54.61,71.12 55.88,72.39 60.96,72.39 62.23,73.66 62.23,76.2 60.96,80.01 E14.13
  Bottom 0.406: E11.9 53.34,60.96 41.91,60.96 38.1,58.42 34.29,57.15 29.21,54.61 13.97,41.91 8.89,41.91 U$3.AP2
N$69
  Bottom 0.406: U$3.AM2 8.89,35.56 13.97,35.56 30.48,52.07 35.56,54.61 41.91,57.15 44.45,58.42 55.88,58.42 59.69,59.69 E11.12 E11.13
N$70
  Bottom 0.406: U$3.AN2 10.16,39.37 15.24,39.37 21.59,45.72 31.75,54.61 44.45,59.69 54.61,59.69 E11.10
N$71  (via drill 0.81)
  Top 0.406: v38.1,114.3 41.91,114.3 43.18,115.57 43.18,125.73 45.72,128.27 63.5,128.27 66.04,125.73 66.04,113.03 67.31,109.22 67.31,100.33 64.77,93.98 64.77,88.9 E14.12
  Bottom 0.406: U$3.BP2 8.89,111.76 13.97,111.76 17.78,113.03 22.86,114.3 v38.1,114.3
N$72
  Bottom 0.406: E14.9 E14.10 E14.11
N$73  (via drill 0.81)
  Top 0.406: v44.45,54.61 46.99,54.61 50.8,57.15 52.07,59.69 E11.8
  Bottom 0.406: v44.45,54.61 E7.4 E7.5
N$74
  Top 0.406: U$3.BB1 8.89,77.47 17.78,77.47 24.13,74.93 33.02,74.93 41.91,80.01 43.18,82.55 43.18,85.09 45.72,85.09 46.99,83.82 E14.8
N$75
  Top 0.406: E10.1 E10.13
  Bottom 0.406: E7.6 36.83,50.8 41.91,55.88 54.61,55.88 64.77,60.96 72.39,60.96 73.66,62.23 73.66,63.5 72.39,64.77 67.31,66.04 43.18,66.04 40.64,63.5 E10.13 36.83,59.69 30.48,57.15 22.86,50.8 15.24,45.72 10.16,45.72 U$3.AR2
N$76
  Bottom 0.406: U$3.AS2 10.16,48.26 13.97,48.26 20.32,50.8 24.13,53.34 27.94,57.15 33.02,59.69 E10.11
N$77
  Top 0.406: U$3.AS1 8.89,48.26 17.78,48.26 20.32,49.53 29.21,57.15 35.56,59.69 38.1,60.96 E10.12
N$78
  Bottom 0.406: E10.10 31.75,60.96 26.67,58.42 21.59,53.34 19.05,52.07 8.89,52.07 U$3.AT2
N$79
  Top 0.406: E10.2 35.56,64.77 33.02,64.77 E10.9
  Bottom 0.406: E10.9 30.48,63.5 29.21,64.77 25.4,64.77 21.59,57.15 19.05,57.15 13.97,54.61 8.89,54.61 U$3.AU2
N$80  (via drill 0.81)
  Top 0.406: v25.4,67.31 35.56,67.31 E10.3
  Bottom 0.406: U$3.AV2 12.7,58.42 20.32,58.42 21.59,59.69 21.59,62.23 24.13,67.31 v25.4,67.31
N$81
  Top 0.406: U$3.AV1 8.89,58.42 20.32,58.42 21.59,59.69 21.59,69.85 24.13,72.39 31.75,72.39 33.02,71.12 E10.5
N$82  (via drill 0.81)
  Top 0.406: U$3.AU1 8.89,54.61 v19.05,54.61
  Bottom 0.406: E10.8 26.67,62.23 25.4,60.96 22.86,55.88 v19.05,54.61
N$83
  Bottom 0.406: U$3.BJ2 10.16,96.52 34.29,96.52 38.1,92.71 E13.2 E13.1
N$84
  Bottom 0.406: E13.3 35.56,92.71 33.02,95.25 24.13,95.25 13.97,92.71 8.89,92.71 U$3.BH2
N$85  (via drill 0.81)
  Top 0.406: E13.4 33.02,87.63 | 33.02,87.63 E13.11 | v49.53,93.98 40.64,87.63 33.02,87.63 | E18.12 v57.15,96.52
  Bottom 0.406: E13.4 33.02,91.44 31.75,92.71 21.59,92.71 13.97,90.17 8.89,90.17 U$3.BF2 | E15.1 85.09,91.44 78.74,97.79 68.58,97.79 66.04,99.06 63.5,99.06 60.96,97.79 v57.15,96.52 v49.53,93.98
N$86  (via drill 0.81)
  Top 0.406: v30.48,77.47 30.48,80.01 | 30.48,80.01 E13.10 | U$3.BD1 8.89,83.82 17.78,83.82 25.4,80.01 30.48,80.01
  Bottom 0.406: E15.13 78.74,78.74 64.77,78.74 62.23,77.47 v30.48,77.47
N$87  (via drill 0.81)
  Top 0.406: v19.05,87.63 v22.86,83.82 | E13.13 41.91,86.36 48.26,86.36 E14.5 E14.4
  Bottom 0.406: v22.86,83.82 24.13,85.09 34.29,85.09 35.56,83.82 E13.12 E13.13 | U$3.BD2 10.16,83.82 13.97,83.82 v19.05,87.63 | E14.5 E14.4
N$88
  Bottom 0.406: E14.6 49.53,91.44 50.8,92.71 59.69,92.71 63.5,95.25 67.31,95.25 69.85,93.98 74.93,93.98 77.47,92.71 81.28,92.71 82.55,91.44 E15.2
N$89
  Top 0.406: U$3.BE1 8.89,86.36 13.97,86.36 16.51,88.9 20.32,88.9 25.4,86.36 E13.8
N$90  (via drill 0.81)
  Top 0.406: U$3.BC1 8.89,80.01 19.05,80.01 v24.13,77.47
  Bottom 0.406: E15.12 77.47,80.01 64.77,80.01 62.23,78.74 26.67,78.74 v24.13,77.47
N$91  (via drill 0.81)
  Top 0.406: U$3.BA1 8.89,73.66 36.83,73.66 41.91,76.2 44.45,78.74 v44.45,83.82
  Bottom 0.406: E15.4 77.47,88.9 76.2,87.63 67.31,87.63 63.5,86.36 49.53,86.36 v44.45,83.82
N$92  (via drill 0.81)
  Top 0.406: E15.6 72.39,91.44 76.2,95.25 v78.74,95.25 | E18.13 v59.69,95.25
  Bottom 0.406: v59.69,95.25 64.77,97.79 66.04,97.79 69.85,95.25 v78.74,95.25
N$93  (via drill 0.81)
  Top 0.406: v68.58,77.47 68.58,83.82 69.85,85.09 74.93,85.09 E15.3
  Bottom 0.406: E10.6 30.48,71.12 34.29,74.93 40.64,74.93 44.45,76.2 66.04,76.2 v68.58,77.47
N$95
  Bottom 0.406: E18.9 E18.10 E18.11
N$96
  Top 0.406: U$3.BF1 8.89,90.17 16.51,90.17 26.67,93.98 43.18,93.98 45.72,95.25 E18.8
N$97  (via drill 0.81)
  Top 0.406: E19.2 82.55,110.49 80.01,113.03 v71.12,113.03 | v21.59,90.17 26.67,92.71 44.45,92.71 46.99,93.98 49.53,96.52 52.07,96.52 55.88,92.71 60.96,92.71 62.23,93.98 64.77,97.79 66.04,101.6 66.04,109.22 v63.5,113.03
  Bottom 0.406: U$3.BE2 10.16,86.36 13.97,86.36 16.51,88.9 19.05,90.17 v21.59,90.17 | v71.12,113.03 68.58,115.57 66.04,115.57 v63.5,113.03
VCC  (via drill 0.81)
  Top 0.813: v21.59,29.21 C6.1 | C8.1 115.57,29.21 115.57,34.29 114.3,35.56 110.49,35.56 107.95,38.1 E9.14 C11.1 114.3,44.45 114.3,48.26 109.22,53.34 v109.22,64.77 | C10.1 83.82,36.83 86.36,33.02 86.36,29.21 C7.1 | C16.1 E20.14 107.95,96.52 v110.49,90.17 | C13.1 74.93,60.96 77.47,59.69 92.71,59.69 93.98,60.96 E12.14 | E23.14 85.09,121.92 C17.1 | E16.14 C15.1
  Bottom 0.813: U$3.AA2 8.89,4.13 8.89,3.81 19.05,3.81 22.86,2.54 27.94,2.54 | 27.94,2.54 27.94,7.62 25.4,8.89 25.4,12.7 27.94,13.97 R1.2 C3.1 34.29,21.59 C6.1 36.83,24.13 52.07,24.13 54.61,21.59 E4.14 | E2.14 C4.1 83.82,5.08 | E1.14 59.69,2.54 | 59.69,2.54 74.93,2.54 83.82,5.08 | 59.69,2.54 27.94,2.54 | 83.82,5.08 111.76,5.08 113.03,6.35 C5.1 | C5.1 E3.14 | E5.14 C7.1 85.09,27.94 106.68,27.94 107.95,26.67 | 107.95,26.67 E6.14 | 107.95,26.67 C8.1 115.57,22.86 115.57,15.24 C5.1 | E9.14 C11.1 | E8.14 C10.1 | C9.1 50.8,41.91 E7.14 49.53,39.37 48.26,38.1 31.75,38.1 26.67,35.56 v21.59,29.21 | E12.14 C14.1 105.41,68.58 | C13.1 E11.14 67.31,63.5 66.04,64.77 49.53,64.77 C12.1 E10.14 | C18.1 E24.14 107.95,114.3 | 105.41,68.58 v109.22,64.77 | 105.41,68.58 109.22,73.66 C15.1 | v110.49,90.17 E16.14 107.95,81.28 106.68,80.01 92.71,80.01 87.63,82.55 E15.14 85.09,83.82 83.82,85.09 67.31,85.09 E14.14 62.23,81.28 60.96,80.01 43.18,80.01 E13.14 38.1,80.01 21.59,80.01 15.24,73.66 11.43,73.66 U$3.BA2 | E20.14 107.95,100.33 106.68,99.06 85.09,99.06 | 85.09,99.06 E19.14 | 85.09,99.06 68.58,99.06 66.04,101.6 E18.14 60.96,99.06 44.45,99.06 E17.14 | 107.95,114.3 110.49,113.03 114.3,109.22 111.76,104.14 C16.1 | 107.95,114.3 104.14,113.03 91.44,113.03 86.36,114.3 85.09,115.57 E23.14 | C17.1 85.09,121.92 76.2,121.92 67.31,119.38 E22.14 60.96,114.3 48.26,114.3 E21.14

### Text on the board
Top: SIDE 1 | FLIP CHIP
Bottom: STEP COUNTER AND CONTROL | M219B